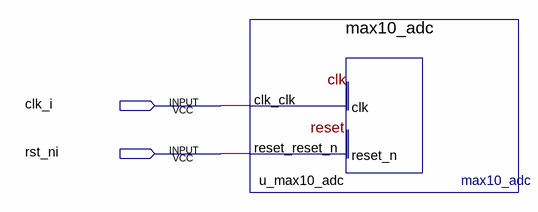
[diagram p0: schematic sheet]
// Quartus schematic top.bdf as structural Verilog: 1 symbols, 2 pins
module top (
  input  clk_i,
  input  rst_ni
);

  max10_adc u_max10_adc (.clk_clk(clk_i), .reset_reset_n(rst_ni));
endmodule
